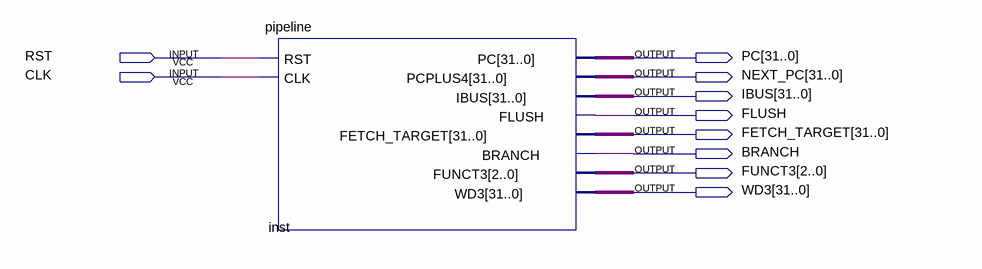
[diagram p0: schematic sheet]
// Quartus schematic multicorecpu.bdf as structural Verilog: 1 symbols, 10 pins
module multicorecpu (
  input  RST,
  input  CLK,
  output [31:0] PC,
  output [31:0] NEXT_PC,
  output [31:0] IBUS,
  output FLUSH,
  output [31:0] FETCH_TARGET,
  output BRANCH,
  output [2:0] FUNCT3,
  output [31:0] WD3
);

  pipeline inst (
    .RST(RST), .CLK(CLK), .PC(PC), .PCPLUS4(NEXT_PC), .IBUS(IBUS), .FLUSH(FLUSH),
    .FETCH_TARGET(FETCH_TARGET), .BRANCH(BRANCH), .FUNCT3(FUNCT3), .WD3(WD3));
endmodule
